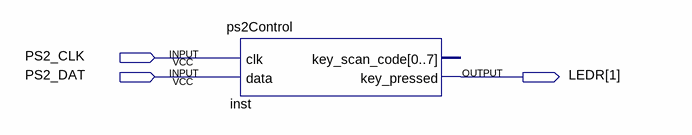
[diagram p0: schematic sheet]
// Quartus schematic test.bdf as structural Verilog: 1 symbols, 3 pins
module test (
  input  PS2_CLK,
  input  PS2_DAT,
  output [1:1] LEDR
);

  ps2Control inst (.clk(PS2_CLK), .data(PS2_DAT), .key_pressed(LEDR[1]));  // open: key_scan_code
endmodule
